# EasyEDA schematic 1-Schematic_ENVF.json
TITLE: ENVF; REV: 1.0; Date: 2025-04-14; Sheet: 1/1; Drawn By: Tilman; Company: TekNoiseLab
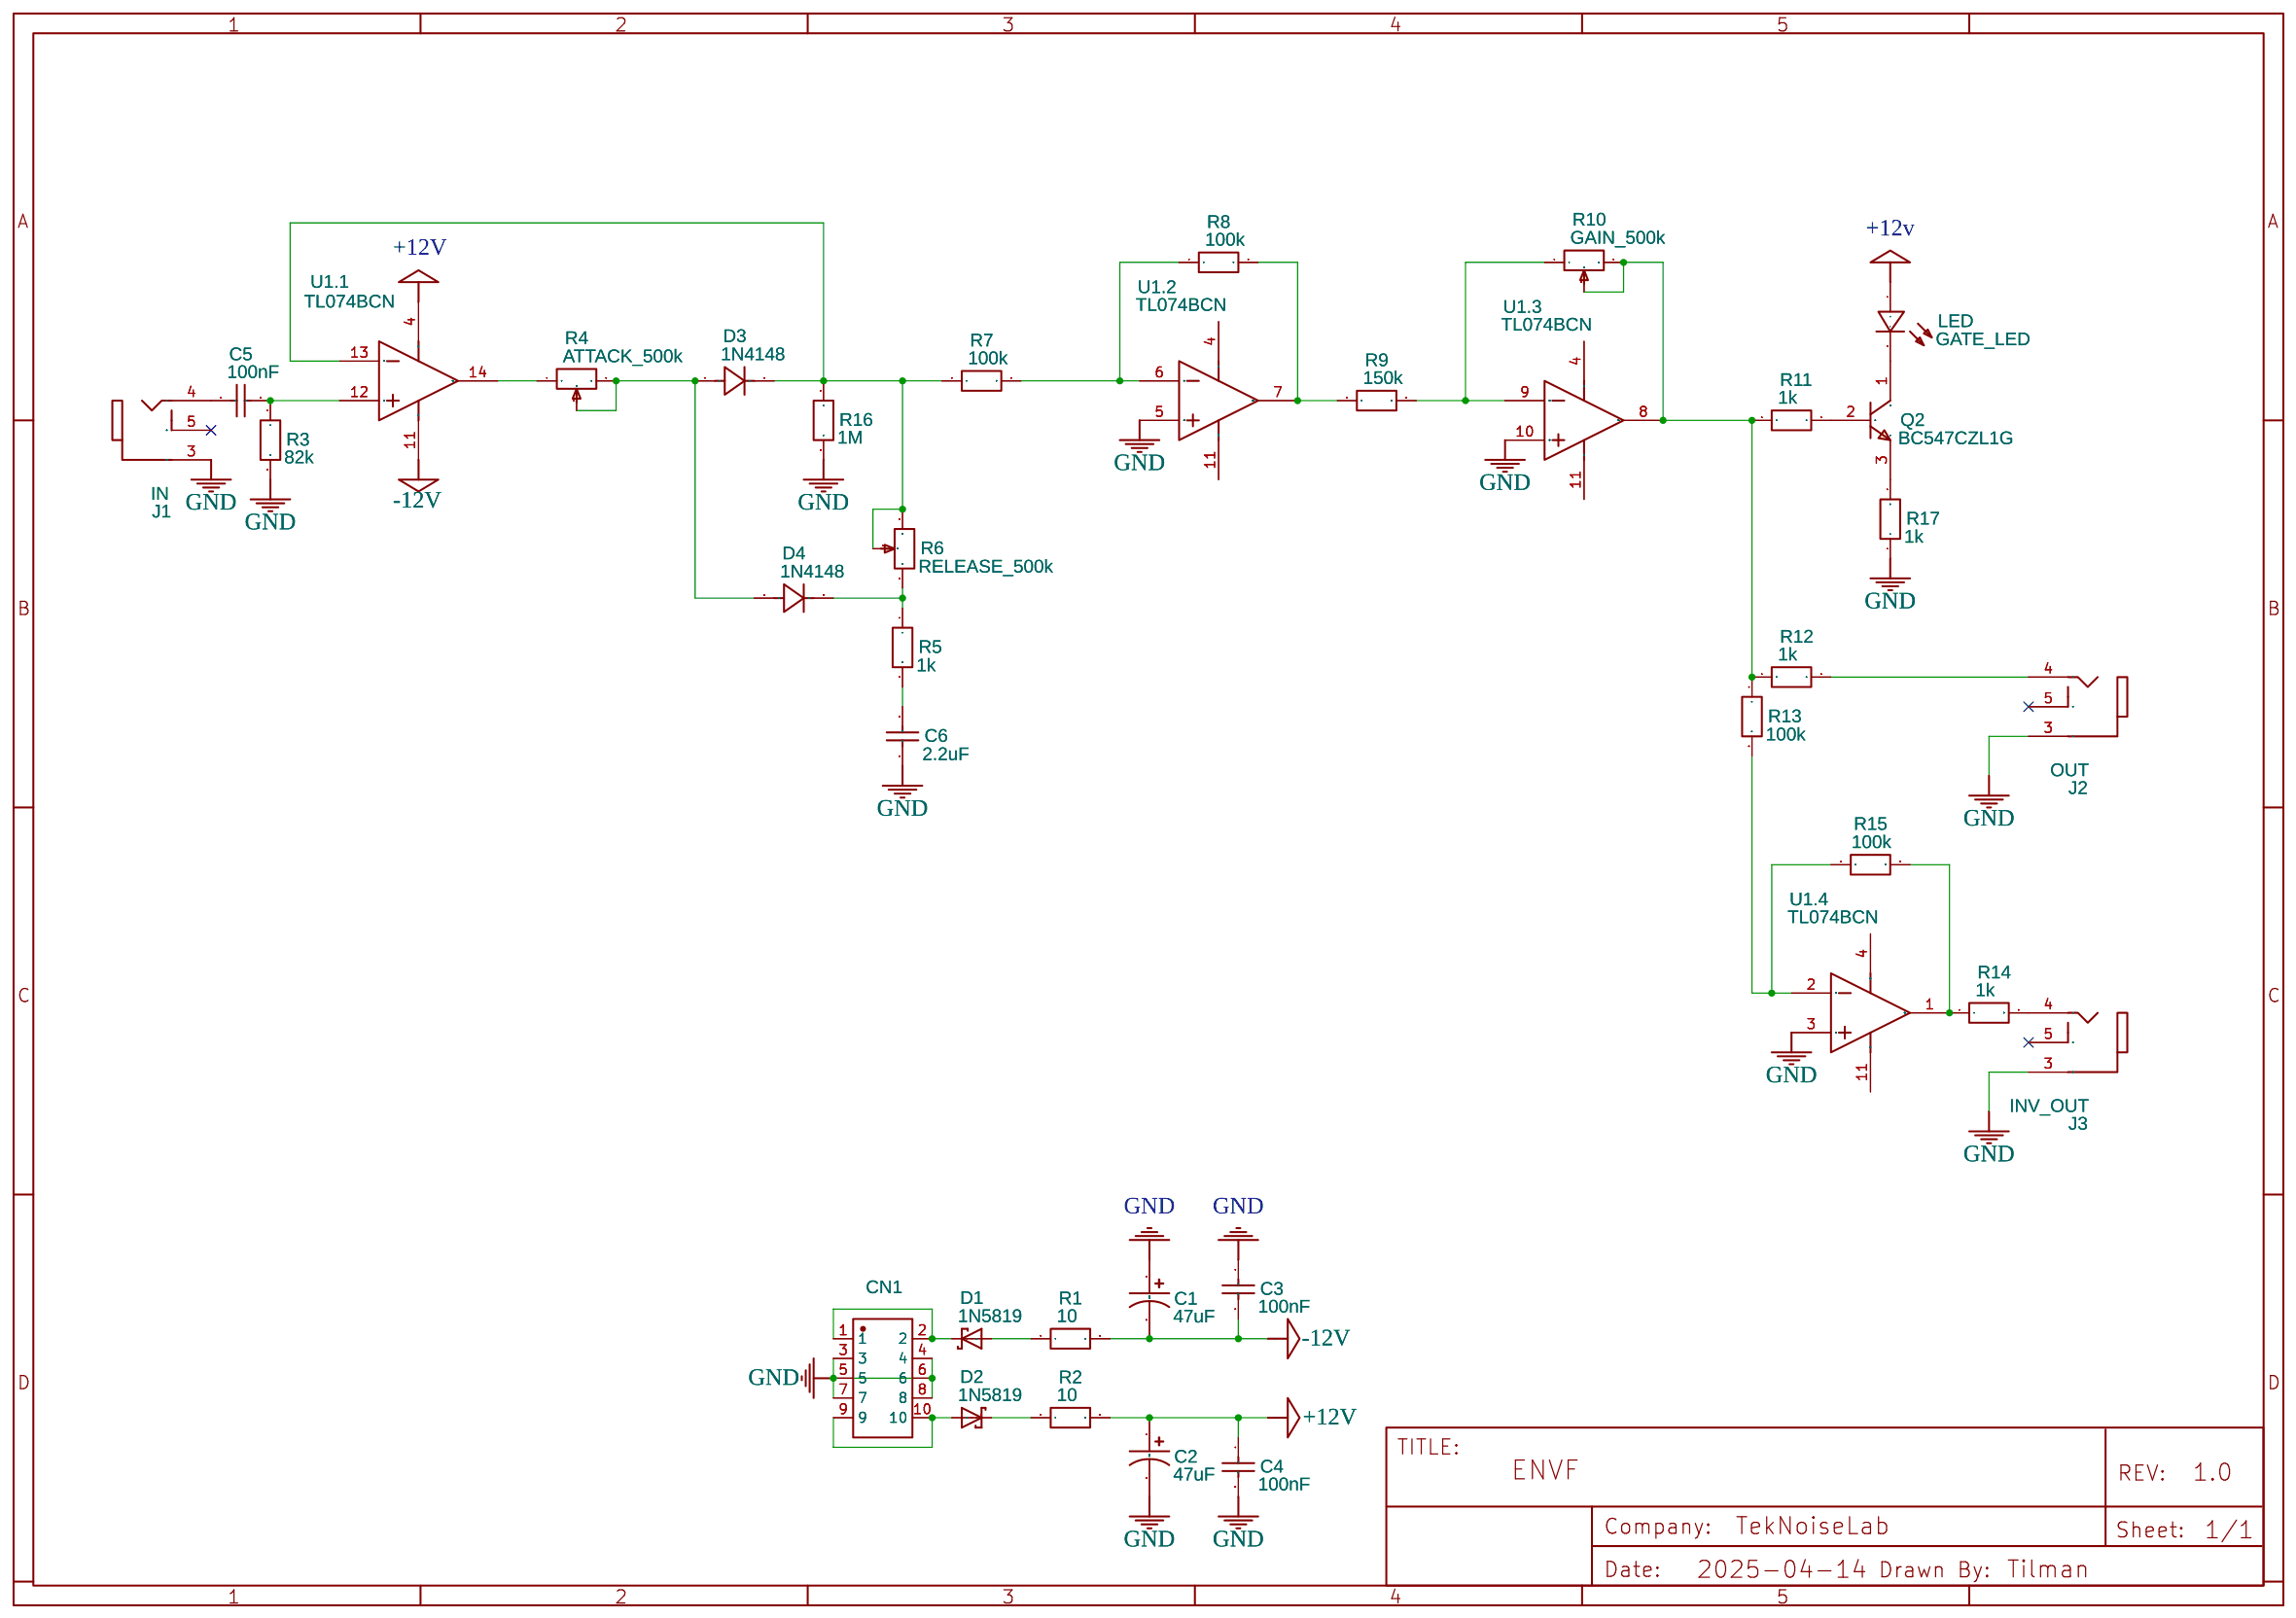
[diagram p0: schematic sheet]

## Parts
C1  47uF  [CAP-TH_BD5.0-P2.00-D0.5-FD]
C2  47uF  [CAP-TH_BD5.0-P2.00-D0.5-FD]
C3  100nF  [CAP-2.5*6.5*7.2]
C4  100nF  [CAP-2.5*6.5*7.2]
C5  100nF  [CAP-2.5*6.5*7.2]
C6  2.2uF  [CAP-2.5*6.5*7.2]
CN1  DC3-2.54-10PAS  [CONN-TH_10P-P2.54_DC3-2.54-10PAS]
D1  1N5819  [DO41-7.6]
D2  1N5819  [DO41-7.6]
D3  1N4148  [DO-35_BD2.2-L4.0-D0.50_1N4148]
D4  1N4148  [DO-35_BD2.2-L4.0-D0.50_1N4148]
J1  IN  [PJM323 TAYDA A-2557]
J2  OUT  [PJM323 TAYDA A-2557]
J3  INV_OUT  [PJM323 TAYDA A-2557]
LED  GATE_LED  [LED-3MM/2.54]
Q2  BC547CZL1G  [ONSC-TO-92-3-29-11_AM_BL]
R1  10  [RES-TH_BD2.4-L6.3-P10.30-D0.6]
R2  10  [RES-TH_BD2.4-L6.3-P10.30-D0.6]
R3  82k  [RES-TH_BD2.4-L6.3-P10.30-D0.6]
R4  ATTACK_500k  [RES-ADJ-TH_RK097111080J]
R5  1k  [RES-TH_BD2.4-L6.3-P10.30-D0.6]
R6  RELEASE_500k  [RES-ADJ-TH_RK097111080J]
R7  100k  [RES-TH_BD2.4-L6.3-P10.30-D0.6]
R8  100k  [RES-TH_BD2.4-L6.3-P10.30-D0.6]
R9  150k  [RES-TH_BD2.4-L6.3-P10.30-D0.6]
R10  GAIN_500k  [RES-ADJ-TH_RK097111080J]
R11  1k  [RES-TH_BD2.4-L6.3-P10.30-D0.6]
R12  1k  [RES-TH_BD2.4-L6.3-P10.30-D0.6]
R13  100k  [RES-TH_BD2.4-L6.3-P10.30-D0.6]
R14  1k  [RES-TH_BD2.4-L6.3-P10.30-D0.6]
R15  100k  [RES-TH_BD2.4-L6.3-P10.30-D0.6]
R16  1M  [RES-TH_BD2.4-L6.3-P10.30-D0.6]
R17  1k  [RES-TH_BD2.4-L6.3-P10.30-D0.6]
U1  TL074BCN  [DIP14]  (sections 1,2,3,4)

## Library data of the parts
C1 C2 = 50MS710MEFCTZ5X7: Contributor: lcsc; Supplier: LCSC; Supplier Part: C5115261; Manufacturer: rubycon(红宝石)
C3-C6 = 0.22uF 5% 100VCalibration capacitor: Supplier Part: undefined; Supplier: LCSC; Manufacturer: ReliaPro
CN1 = DC3-2.54-10PAS: Contributor: lcsc; Supplier: LCSC; Supplier Part: C2977596; Manufacturer: ZHOURI(洲日); JLCPCB Part Class: Extended Part
D1 D2 = 1N5819-B: 1.0A SCHOTTKY BARRIER RECTIFIER
D3 D4 = 1N4148_C18195411: Supplier: LCSC; Supplier Part: C18195411; Manufacturer: LJ(朗捷); JLCPCB Part Class: Extended Part; Contributor: lcsc
J1-J3 = PJ323M Tayda: Supplier: Tayda; Supplier Part: A-2557; Contributor: flounderguts
LED = LED-3MM: Supplier: LCSC; Manufacturer: EVERLIGHT; Manufacturer Part: 204-10SURD/S530-A3; Supplier Part: C99772
Q2 = BC547CZL1G: Amplifier Transistor, NPN Silicon, 3-Pin TO-92, Pb-Free, Ammo Box
R1-R3 R5 R7-R9 R11-R17 = Res_AXIAL-0.4(1/4W)_US
R4 R6 R10 = RK097111080J: Resistance(Ohms): 10K; Supplier: LCSC; Manufacturer: ALPSALPINE(阿尔卑斯阿尔派); Supplier Part: C97444; JLCPCB Part Class: Extended Part
U1 = TL074BCN: Low-Noise JFET-Input Operational Amplifier, 7 to 36 V, 0 to 70 degC, 14-pin DIP (N14), Pb-Free (RoHS); subpart_no: 1

## Nets
+12V: C2.1 C4.1 R2.2 U1.4(VCC+)
+12v: LED.1(+)
-12V: C1.2 C3.2 R1.2 U1.11(VCC-)
GND: C1.1 C2.2 C3.1 C4.2 C6.2 CN1.3 CN1.4 CN1.5 CN1.6 CN1.7 CN1.8 J1.3 J2.3 J3.3 R3.2 R16.2 R17.1 U1.3(IN1+) U1.5(IN2+) U1.10(IN3+)
Net-(C5-1): C5.1 J1.4
Net-(C5-2): C5.2 R3.1 U1.12(IN4+)
Net-(C6-1): C6.1 R5.2
Net-(CN1-1): CN1.1 CN1.2 D1.C
Net-(CN1-9): CN1.9 CN1.10 D2.A
Net-(D1-A): D1.A R1.1
Net-(D2-C): D2.C R2.1
Net-(D3-1): D3.1(A) D4.1(A) R4.2 R4.3
Net-(D3-2): D3.2(C) R6.1 R6.2 R7.1 R16.1 U1.13(IN4-)
Net-(D4-2): D4.2(C) R5.1 R6.3
Net-(J2-4): J2.4 R12.2
Net-(J3-4): J3.4 R14.2
Net-(LED-2): LED.2(-) Q2.1(C)
Net-(Q2-2): Q2.2(B) R11.2
Net-(Q2-3): Q2.3(E) R17.2
Net-(R4-1): R4.1 U1.14(OUT4)
Net-(R7-2): R7.2 R8.1 U1.6(IN2-)
Net-(R8-2): R8.2 R9.1 U1.7(OUT2)
Net-(R9-2): R9.2 R10.1 U1.9(IN3-)
Net-(R10-2): R10.2 R10.3 R11.1 R12.1 R13.1 U1.8(OUT3)
Net-(R13-2): R13.2 R15.1 U1.2(IN1-)
Net-(R14-1): R14.1 R15.2 U1.1(OUT1)

Not connected (* = marked no-connect by the designer): J1 5*; J2 5*; J3 5*
